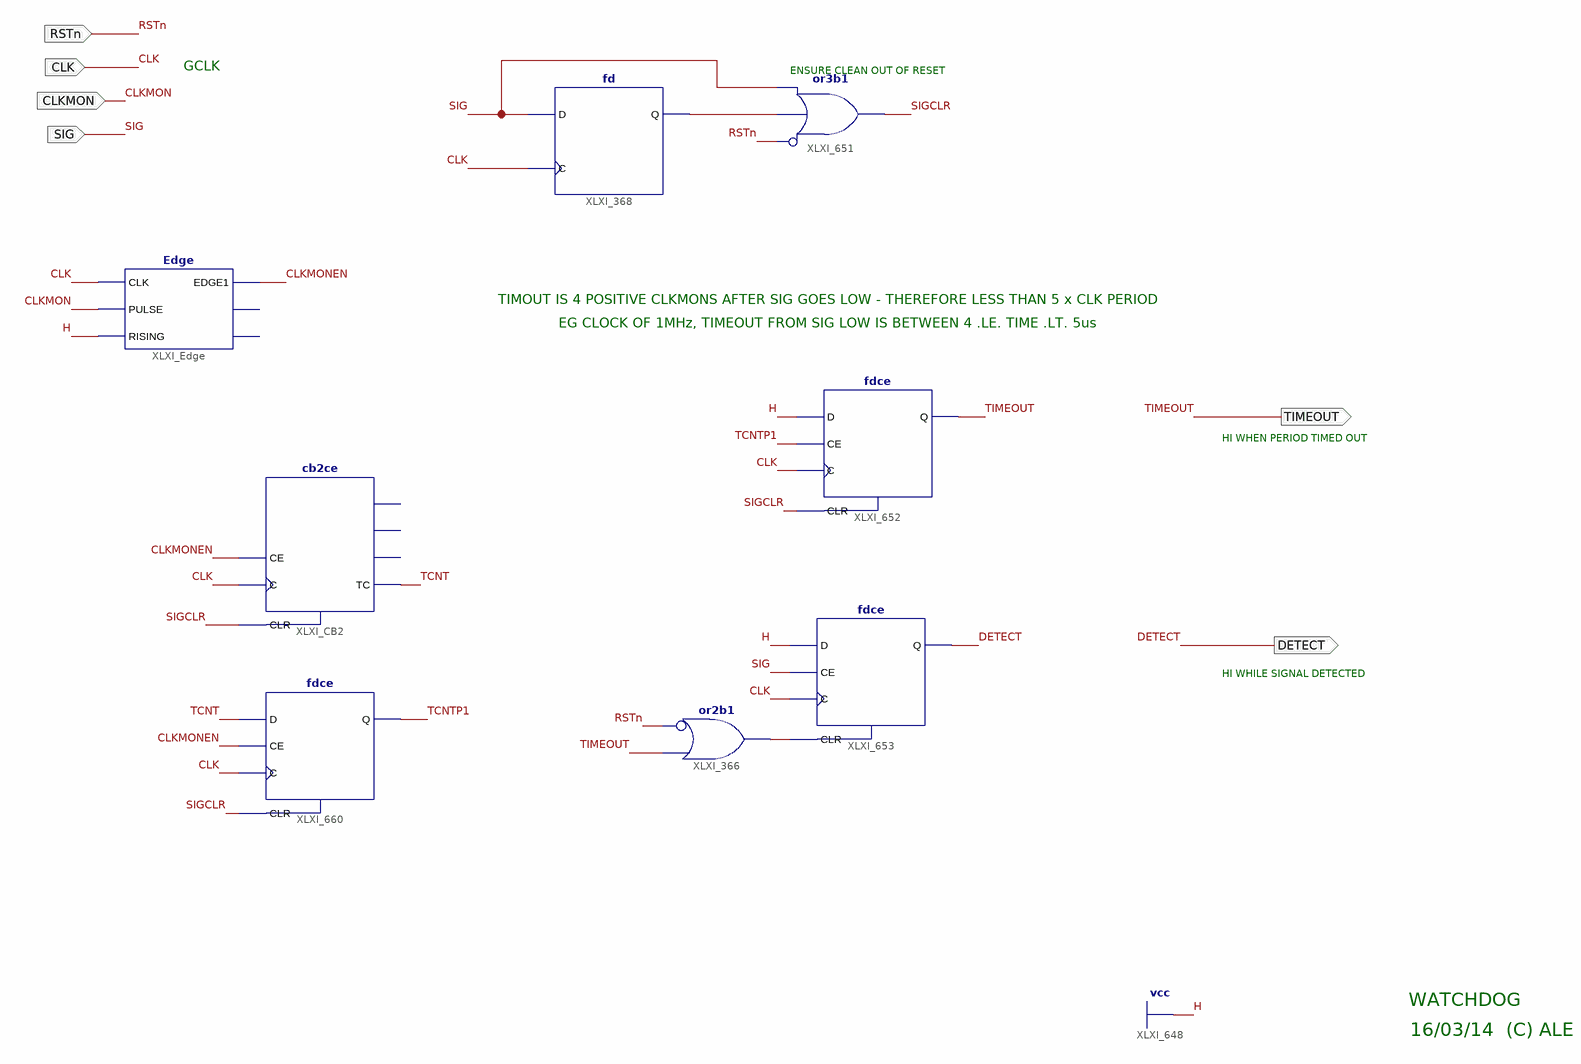
[diagram p0: schematic sheet 1]
// Xilinx ISE schematic WatchDog.sch (spartan3e) as structural Verilog: 8 symbols, 6 ports
module WatchDog (
  input  RSTn,
  input  CLK,
  input  SIG,
  input  CLKMON,
  output TIMEOUT,
  output DETECT
);

  wire CLKMONEN, SIGCLR, TCNT, TCNTP1, XLXN_1004, XLXN_1028;

  cb2ce XLXI_CB2 (.C(CLK), .CE(CLKMONEN), .CLR(SIGCLR), .TC(TCNT));  // open: CEO, Q0, Q1
  fd XLXI_368 (.C(CLK), .D(SIG), .Q(XLXN_1004));
  Edge XLXI_Edge (.CLK(CLK), .EDGE1(CLKMONEN), .PULSE(CLKMON), .RISING(1'b1));  // open: EDGE0, EDGEQUICK
  or XLXI_651 (SIGCLR, ~RSTn, XLXN_1004, SIG);  // or3b1
  fdce XLXI_653 (.C(CLK), .CE(SIG), .CLR(XLXN_1028), .D(1'b1), .Q(DETECT));
  or XLXI_366 (XLXN_1028, ~RSTn, TIMEOUT);  // or2b1
  fdce XLXI_652 (.C(CLK), .CE(TCNTP1), .CLR(SIGCLR), .D(1'b1), .Q(TIMEOUT));
  fdce XLXI_660 (.C(CLK), .CE(CLKMONEN), .CLR(SIGCLR), .D(TCNT), .Q(TCNTP1));

  // Notes on the sheet:
  //   GCLK
  //   ENSURE CLEAN OUT OF RESET
  //   TIMOUT IS 4 POSITIVE CLKMONS AFTER SIG GOES LOW - THEREFORE LESS THAN 5 x CLK PERIOD
  //   EG CLOCK OF 1MHz, TIMEOUT FROM SIG LOW IS BETWEEN 4 .LE. TIME .LT. 5us
  //   HI WHEN PERIOD TIMED OUT
  //   HI WHILE SIGNAL DETECTED
  //   WATCHDOG
  //   16/03/14  (C) ALE
endmodule
